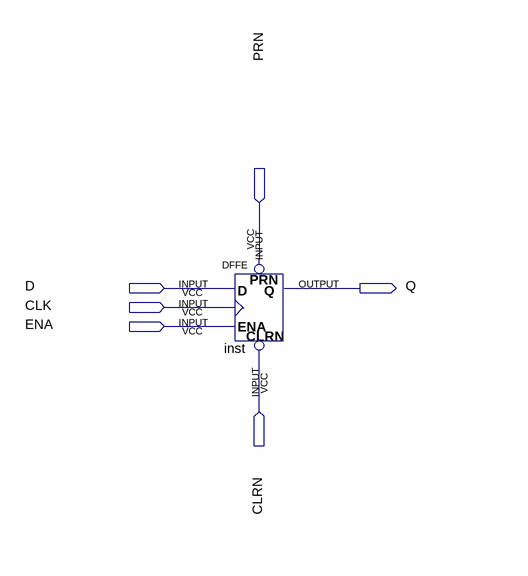
[diagram p0: schematic sheet]
// Quartus schematic dffe_project.bdf as structural Verilog: 1 symbols, 6 pins
module dffe_project (
  input  PRN,
  input  D,
  input  CLK,
  input  ENA,
  input  CLRN,
  output Q
);

  DFFE inst (.PRN(PRN), .CLRN(CLRN), .D(D), .CLK(CLK), .ENA(ENA), .Q(Q));
endmodule
